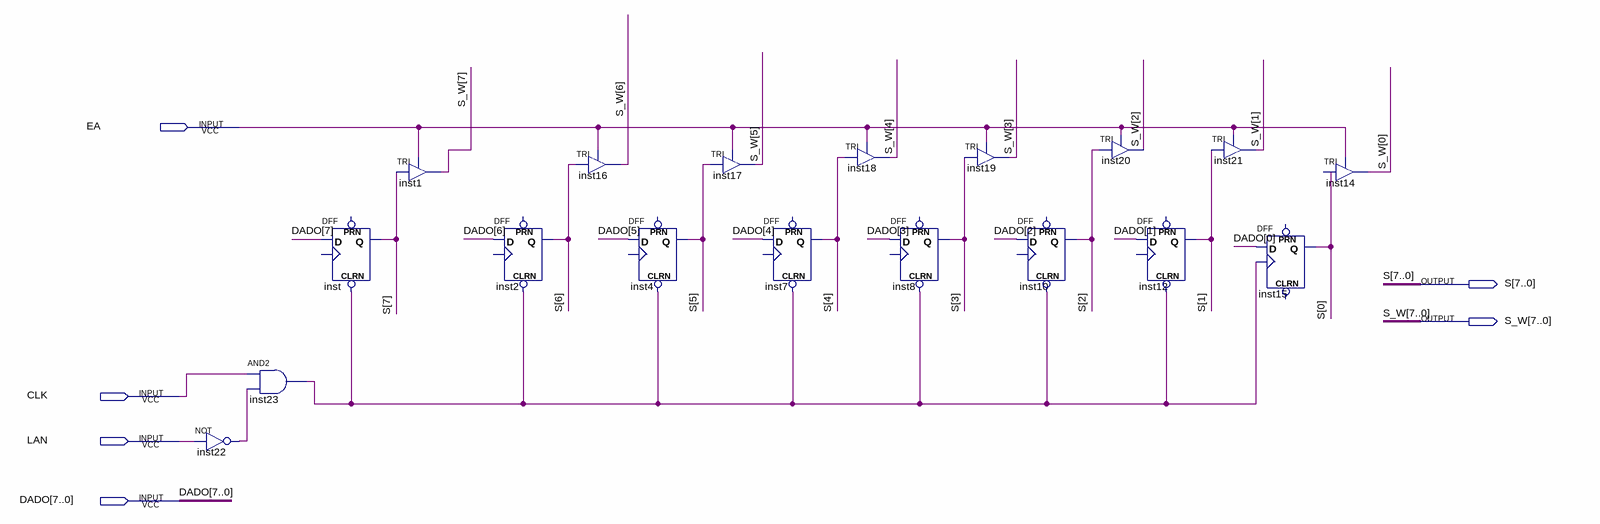
[diagram p0: schematic sheet]
// Quartus schematic Acumulador-A.bdf as structural Verilog: 18 symbols, 6 pins
module \Acumulador-A  (
  input  EA,
  input  CLK,
  input  LAN,
  input  [7:0] DADO,
  output [7:0] S,
  output [7:0] S_W
);

  wire inst22_out, inst23_out;

  not inst22 (inst22_out, LAN);
  and inst23 (inst23_out, CLK, inst22_out);
  DFF inst (.CLRN(inst23_out), .D(DADO[7]), .Q(S[7]));  // open: CLK, PRN
  TRI inst1 (.IN(S[7]), .OE(EA), .OUT(S_W[7]));
  DFF inst2 (.CLRN(inst23_out), .D(DADO[6]), .Q(S[6]));  // open: CLK, PRN
  TRI inst16 (.IN(S[6]), .OE(EA), .OUT(S_W[6]));
  DFF inst4 (.CLRN(inst23_out), .D(DADO[5]), .Q(S[5]));  // open: CLK, PRN
  TRI inst17 (.IN(S[5]), .OE(EA), .OUT(S_W[5]));
  DFF inst7 (.CLRN(inst23_out), .D(DADO[4]), .Q(S[4]));  // open: CLK, PRN
  TRI inst18 (.IN(S[4]), .OE(EA), .OUT(S_W[4]));
  DFF inst8 (.CLRN(inst23_out), .D(DADO[3]), .Q(S[3]));  // open: CLK, PRN
  TRI inst19 (.IN(S[3]), .OE(EA), .OUT(S_W[3]));
  DFF inst10 (.CLRN(inst23_out), .D(DADO[2]), .Q(S[2]));  // open: CLK, PRN
  TRI inst20 (.IN(S[2]), .OE(EA), .OUT(S_W[2]));
  DFF inst12 (.CLRN(inst23_out), .D(DADO[1]), .Q(S[1]));  // open: CLK, PRN
  TRI inst21 (.IN(S[1]), .OE(EA), .OUT(S_W[1]));
  DFF inst15 (.CLK(inst23_out), .D(DADO[0]), .Q(S[0]));  // open: CLRN, PRN
  TRI inst14 (.IN(S[0]), .OE(EA), .OUT(S_W[0]));
endmodule
